# EAGLE design ButtonHighlight (EAGLE 7.2.0)
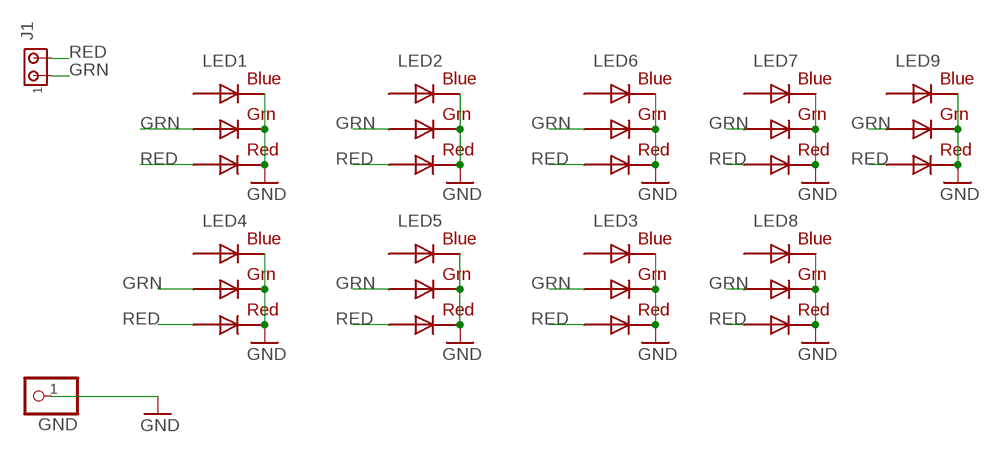
[diagram p0: schematic, sheet 1]

## Parts
GND  PINHD-1X1  [1X01]
J1  MTA02-100  [10X02MTA]
LED1  RGBLED5050  [RGBLED5050]
LED2  RGBLED5050  [RGBLED5050]
LED3  RGBLED5050  [RGBLED5050]
LED4  RGBLED5050  [RGBLED5050]
LED5  RGBLED5050  [RGBLED5050]
LED6  RGBLED5050  [RGBLED5050]
LED7  RGBLED5050  [RGBLED5050]
LED8  RGBLED5050  [RGBLED5050]
LED9  RGBLED5050  [RGBLED5050]

## Nets
GND: GND.1 LED1.4(BLUE_C) LED1.5(RED_C) LED1.6(GREEN_C) LED2.4(BLUE_C) LED2.5(RED_C) LED2.6(GREEN_C) LED3.4(BLUE_C) LED3.5(RED_C) LED3.6(GREEN_C) LED4.4(BLUE_C) LED4.5(RED_C) LED4.6(GREEN_C) LED5.4(BLUE_C) LED5.5(RED_C) LED5.6(GREEN_C) LED6.4(BLUE_C) LED6.5(RED_C) LED6.6(GREEN_C) LED7.4(BLUE_C) LED7.5(RED_C) LED7.6(GREEN_C) LED8.4(BLUE_C) LED8.5(RED_C) LED8.6(GREEN_C) LED9.4(BLUE_C) LED9.5(RED_C) LED9.6(GREEN_C)
GRN: J1.1 LED1.1(GREEN_A) LED2.1(GREEN_A) LED3.1(GREEN_A) LED4.1(GREEN_A) LED5.1(GREEN_A) LED6.1(GREEN_A) LED7.1(GREEN_A) LED8.1(GREEN_A) LED9.1(GREEN_A)
RED: J1.2 LED1.2(RED_A) LED2.2(RED_A) LED3.2(RED_A) LED4.2(RED_A) LED5.2(RED_A) LED6.2(RED_A) LED7.2(RED_A) LED8.2(RED_A) LED9.2(RED_A)
Unconnected: LED1.3(BLUE_A) LED2.3(BLUE_A) LED3.3(BLUE_A) LED4.3(BLUE_A) LED5.3(BLUE_A) LED6.3(BLUE_A) LED7.3(BLUE_A) LED8.3(BLUE_A) LED9.3(BLUE_A)

## Library data of the parts
GND = adafruit:PINHD-1X1: Pin header 1x1 for 0.1" spacing With round pins
J1 = con-amp:MTA02-100: AMP connector
LED1-LED9 = adafruit:RGBLED: For 5050 RGB LEDs, the order of the LEDs may vary from one manufacturer to another!

## Board
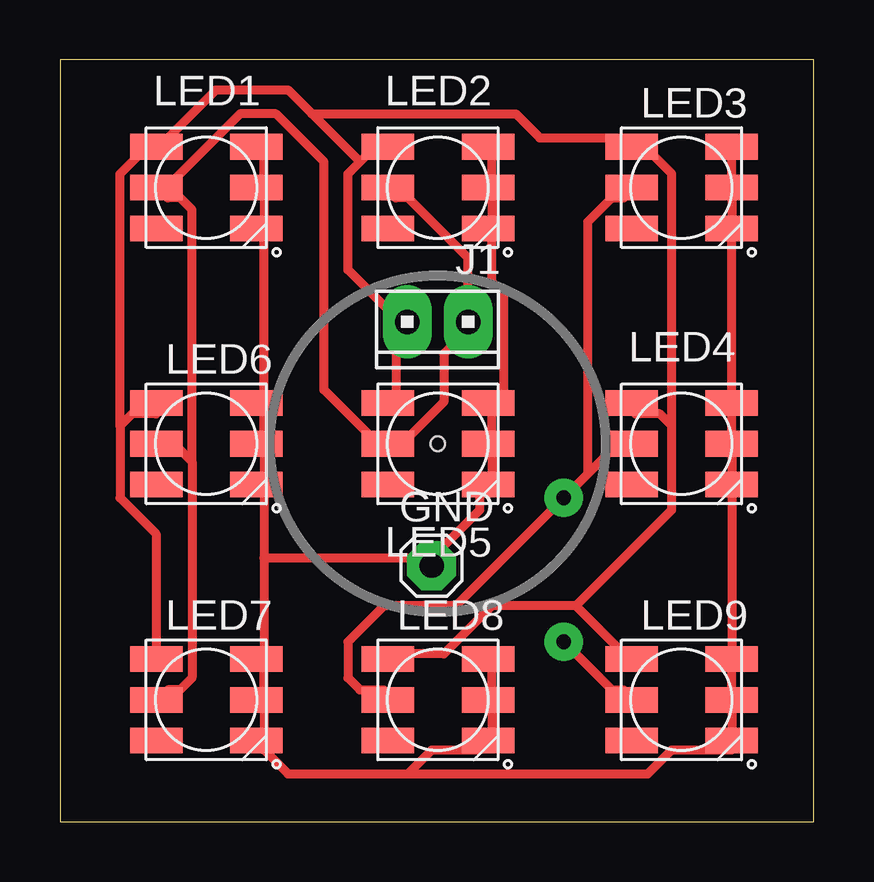
[diagram p1: board, top side]
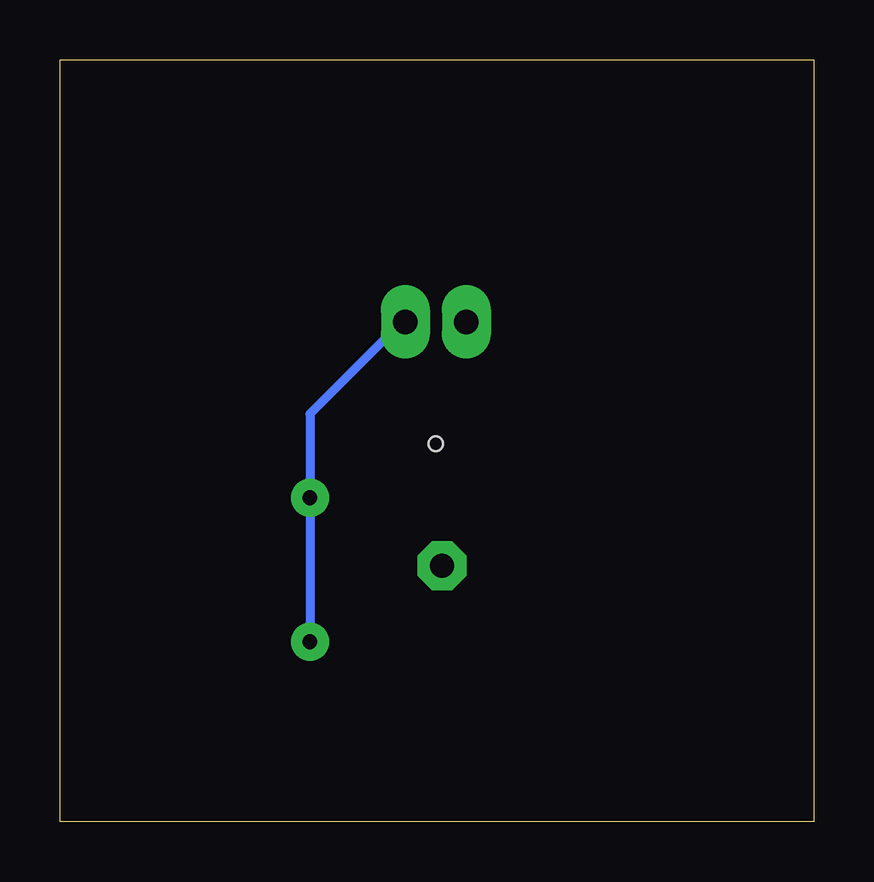
[diagram p2: board, bottom side, seen from below]

Size 31.42 x 31.74 mm. Coordinates in mm from the lower left corner, seen from the top.
Outline: 0,0 31.42,0 31.42,31.74 0,31.74 0,0
Copper layers (1*16): Top 0.035mm / dielectric 1.5mm / Bottom 0.035mm
Design rules "default *": minimum track width 15mil, minimum drill 24mil, track to track 8mil, track to pad 8mil, pad to pad 8mil, via to via 8mil, smd to smd 8mil, copper to edge 1mil, drill to drill 8mil, minimum pad ring 10mil, minimum via ring 8mil, stop-mask expansion 4mil, vias tented up to drill 0mil, thermal gap 10mil
Holes 0.6 mm at 15.75,15.75

### Footprints (pad centres in the part's own frame; a part is rotated, then mirrored left to right if it is on the bottom)
1X01 = drill 1.016 pad 1.93 octagon: 1 0,0
10X02MTA = drill 1.016 long: 1 1.27,0; 2 -1.27,0
RGBLED5050 = smd 2.184 x 1.067: 1 -2.083,1.7; 2 -2.083,0; 3 -2.083,-1.7; 4 2.095,-1.7; 5 2.095,0; 6 2.095,1.7

### Placement (x,y rotation side)
GND  15.49,10.67 0 top
J1  15.75,20.83 180 top
LED1  6.1,26.42 0 top
LED2  15.75,26.42 0 top
LED3  25.91,26.42 0 top
LED4  25.91,15.75 0 top
LED5  15.75,15.75 0 top
LED6  6.1,15.75 0 top
LED7  6.1,5.08 0 top
LED8  15.75,5.08 0 top
LED9  25.91,5.08 0 top

### Tracks (layer width: path | path; a pad name or v marks a point on that pad's centre or on a via)
GND
  Top 0.381: LED3.6 28,28 28,26.5 LED3.5 28,26 28,25 LED3.4 28,24.5 28,17.5 LED4.6 28,17 28,16 LED4.5 28,15.5 28,14.5 LED4.4 28,14 28,7 LED9.6 28,6.5 28,5.5 LED9.5 28,5 28,3.5 LED9.4 28,3 25.5,3 24.5,2 14.5,2 | LED2.6 18,28 18,26.5 LED2.5 18,26 18,25 LED2.4 18,24.5 18,22.5 18.5,22 18.5,18 18,17.5 LED5.6 18,17 18,16 LED5.5 18,15.5 18,14.5 LED5.4 17.5,14 17.5,13 15.5,11 GND.1 15,11 8.5,11 | LED1.6 8.5,28 8.5,26.5 LED1.5 8.5,26 8.5,25 LED1.4 8.5,24.5 8.5,17.5 LED6.6 8.5,17 8.5,16 LED6.5 8.5,15.5 8.5,14.5 LED6.4 8.5,14 8.5,11 | LED8.6 18,6.5 18,5.5 LED8.5 18,5 18,3.5 LED8.4 17.5,3 15.5,3 14.5,2 | 8.5,11 8.5,7 LED7.6 8.5,6.5 8.5,5.5 LED7.5 8.5,5 8.5,3.5 LED7.4 8.5,3 9.5,2 14.5,2
GRN
  Top 0.381: 21.5,9 18,9 16,7 14,7 LED8.1 | 21.5,9 23.5,7 LED9.1 | 25.5,16.5 25,17 24,17 LED4.1 | 25.5,16.5 25.5,13 21.5,9 | 25.5,16.5 25.5,27 24.5,28 24,28 LED3.1 23.5,28.5 20,28.5 19,29.5 10.5,29.5 | LED5.1 14,17.5 14,20.5 J1.1 14,21 12,23 12,27 12.5,27.5 | 12.5,27.5 13,28 13.5,28 LED2.1 | 2.5,16.5 2.5,13.5 4,12 4,7 LED7.1 | 2.5,16.5 3,17 4,17 LED6.1 | 2.5,16.5 2.5,27 3.5,28 4,28 LED1.1 4.5,28.5 6.5,30.5 9.5,30.5 10.5,29.5 | 10.5,29.5 12.5,27.5
RED  (via drill 0.61)
  Top 0.381: 22,14.5 23.5,16 LED4.2 | 22,14.5 v21,13.5 16.5,9 13.5,9 12,7.5 12,6 12.5,5.5 13.5,5.5 LED8.2 | 22,14.5 22,25 23,26 23.5,26 LED3.2 | 5.5,15 5.5,6 5,5.5 4.5,5.5 LED7.2 | 5.5,15 4.5,16 LED6.2 | 5.5,15 5.5,25.5 5,26 4.5,26 LED1.2 4.5,26.5 7.5,29.5 9,29.5 11,27.5 11,18 13.5,15.5 LED5.2 14,16 14.5,16 16,17.5 16,19.5 17,20.5 J1.2 17,21 17,23.5 14.5,26 14,26 LED2.2 | v21,7.5 23,5.5 23.5,5.5 LED9.2
  Bottom 0.381: v21,7.5 v21,13.5 21,17 17.5,20.5 J1.2